# Altium schematic sheet GPIO.SchDoc
size A; SheetNumber: 1; SheetTotal: 1
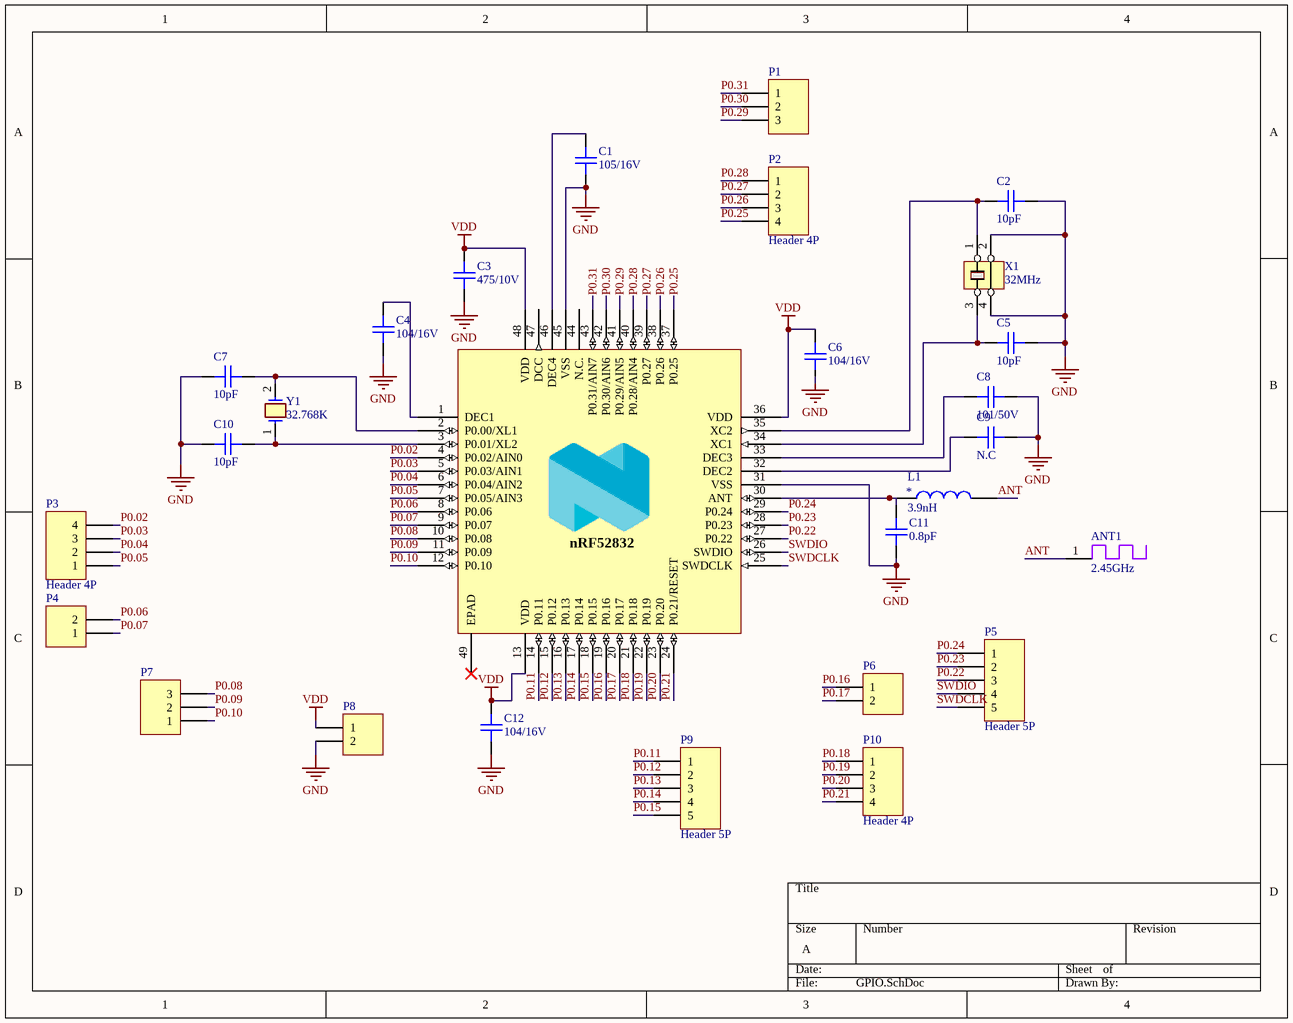
[diagram p0: GPIO.SchDoc]

## Parts
ANT1  2.45GHz  [PATCH ANTEN 2.45GHZ]
C1  105/16V  [CAPC-0603 (1608)]
C2  10pF  [CAPC-0402 (1005)]
C3  475/10V  [CAPC-0603 (1608)]
C4  104/16V  [CAPC-0402 (1005)]
C5  10pF  [CAPC-0402 (1005)]
C6  104/16V  [CAPC-0402 (1005)]
C7  10pF  [CAPC-0402 (1005)]
C8  101/50V  [CAPC-0603 (1608)]
C9  N.C  [CAPC-0603 (1608)]
C10  10pF  [CAPC-0402 (1005)]
C11  0.8pF  [CAPC-0402 (1005)]
C12  104/16V  [CAPC-0402 (1005)]
L1  3.9nH  [IND-0603 (1608)]
P1  (no value)  [HDR1X3]
P2  Header 4P  [HDR1X4]
P3  Header 4P  [HDR1X4]
P4  (no value)  [HDR1X2]
P5  Header 5P  [HDR1X5]
P6  (no value)  [HDR1X2]
P7  (no value)  [HDR1X3]
P8  (no value)  [HDR1X2]
P9  Header 5P  [HDR1X5]
P10  Header 4P  [HDR1X4]
U1  nRF52832_QFAA  [48-VFQFN]  (value not drawn)
X1  32MHz  [CRYSTAL-XRCGB27M120F3M10R0 (2x1.6)]
Y1  32.768K  [XTAL_NX3215SA-32.768K-STD-MUA-14]

## Nets
GND: C1.2 C2.1 C3.1 C4.1 C5.1 C6.1 C7.1 C8.1 C9.1 C10.1 C11.1 C12.1 P8.2 U1.31(VSS) U1.45(VSS) X1.2 X1.4
VDD: C3.2 C6.2 C12.2 P8.1 U1.13(VDD) U1.36(VDD) U1.48(VDD)
ANT: ANT1.1(ANT) L1.2
P0.02: P3.4 U1.4(P0.02/AIN0)
P0.03: P3.3 U1.5(P0.03/AIN1)
P0.04: P3.2 U1.6(P0.04/AIN2)
P0.05: P3.1 U1.7(P0.05/AIN3)
P0.06: P4.2 U1.8(P0.06)
P0.07: P4.1 U1.9(P0.07)
P0.08: P7.3 U1.10(P0.08)
P0.09: P7.2 U1.11(P0.09)
P0.10: P7.1 U1.12(P0.10)
P0.11: P9.1 U1.14(P0.11)
P0.12: P9.2 U1.15(P0.12)
P0.13: P9.3 U1.16(P0.13)
P0.14: P9.4 U1.17(P0.14)
P0.15: P9.5 U1.18(P0.15)
P0.16: P6.1 U1.19(P0.16)
P0.17: P6.2 U1.20(P0.17)
P0.18: P10.1 U1.21(P0.18)
P0.19: P10.2 U1.22(P0.19)
P0.20: P10.3 U1.23(P0.20)
P0.21: P10.4 U1.24(P0.21/RESET)
P0.22: P5.3 U1.27(P0.22)
P0.23: P5.2 U1.28(P0.23)
P0.24: P5.1 U1.29(P0.24)
P0.25: P2.4 U1.37(P0.25)
P0.26: P2.3 U1.38(P0.26)
P0.27: P2.2 U1.39(P0.27)
P0.28: P2.1 U1.40(P0.28/AIN4)
P0.29: P1.3 U1.41(P0.29/AIN5)
P0.30: P1.2 U1.42(P0.30/AIN6)
P0.31: P1.1 U1.43(P0.31/AIN7)
SWDCLK: P5.5 U1.25(SWDCLK)
SWDIO: P5.4 U1.26(SWDIO)
NetC1_1: C1.1 U1.46(DEC4)
NetC2_2: C2.2 U1.35(XC2) X1.1
NetC4_2: C4.2 U1.1(DEC1)
NetC5_2: C5.2 U1.34(XC1) X1.3
NetC7_2: C7.2 U1.2(P0.00/XL1) Y1.2
NetC8_2: C8.2 U1.33(DEC3)
NetC9_2: C9.2 U1.32(DEC2)
NetC10_2: C10.2 U1.3(P0.01/XL2) Y1.1
NetC11_2: C11.2 L1.1 U1.30(ANT)

Not connected (* = marked no-connect by the designer): U1 44(N.C.) 47(DCC) 49(EPAD)*

## Notes on the sheet
- (in symbol nRF52832_QFAA) nRF52832

## Library data of the parts
ANT1 = PCB antenna 2.45GHZ: Value: 2.45GHz
C1 = CC0603KRX7R7BB105: CAP CER 1uF 10% 16V X7R 0603; Solder: SMT; CMT: 105/16V; MPN: CC0603KRX7R7BB105; Category: CAPACITOR; PinCount: 2
C2 C5 C7 C10 C11 = C0402C100J3GACTU: CAP CER 10PF 25V C0G/NP0 0402; MFR: KEMET; CMT: 10pF/25V; Solder: SMT; MPN: C0402C100J3GACTU; Category: CAPACITOR; Digikey MPN: 399-7746-1-ND
C3 = CL10A475KP8NNNC: CAP CER 4.7uF 10% 10V X5R 0603; Solder: SMT; MPN: CL10A475KP8NNNC; CMT: 475/10V; Category: CAPACITOR; PinCount: 2
C4 C6 C12 = CC0402KRX7R7BB104: CAP CER 0.1UF 16V X7R 0402; MFR: Yageo; Solder: SMT; MPN: CC0402KRX7R7BB104; Category: CAPACITOR; CMT: 104/16V
C8 = GRM1885C1H101JA01D: CAP CER 100pF 5% 50V C0G/NP0 0603; Solder: SMT; MPN: GRM1885C1H101JA01D; CMT: 101/50V; Category: CAPACITOR; PinCount: 2
C9 = GRM1885C1H101JA01D: CAP CER 100pF 5% 50V C0G/NP0 0603; Solder: SMT; CMT: 101/50V; MPN: GRM1885C1H101JA01D; Category: CAPACITOR; PinCount: 2
L1 = HK16083N9S-T: FIXED IND 3.9NH 300MA 140 MOHM; Solder: SMT; MPN: HK16083N9S-T; CMT: 3.9nH; Category: FERRITE BEAD; PinCount: 2
P1 P7 = Header 3x1: Header, 3-Pin, pitch 2.54mm; Solder: WAVE
P2 P3 P10 = Header 4x1: Header, 4 Pin Pitch 2.54mm; MPN: S1012EC-40-ND; Solder: WAVE; CMT: Header 4P
P4 P6 P8 = Header 2x1: Header, 2-Pin, pitch 2.54mm; Solder: WAVE
P5 P9 = Header 5x1: Header, 5 Pin Pitch 2.54mm; MPN: S1012EC-40-ND; Solder: WAVE; CMT: Header 5P
U1 = nRF52832_QFAA: Multi-protocol Bluetooth low energy, ANT, and 2.4 GHz proprietary system on chip; MFR: Nordic Semiconductor; MPN: nRF52832_QFAA
X1 = R2016-32.000-8-F-1010-EXT-TR: XTAL 32MHZ 8PF SMD; MFR: Raltron Electronics; Solder: SMT; CMT: 32MHz; MPN: R2016-32.000-8-F-1010-EXT-TR; Category: CRYSTAL
Y1 = NX3215SA-32.768K-STD-MUA-14: 32.768kHz Â±20ppm Crystal 6pF 70 kOhms 2-SMD, No Lead  MANUFACTURER: NIHON DEMPA KOGYO; MF: {'manufacturer': u'NDK America,'}; Price: None; Value: *; MP: NX3215SA-32.768K-STD-MUA-14; Availability: Unavailable; Package: None